# EAGLE board esp32_logging (EAGLE 9.6.2)
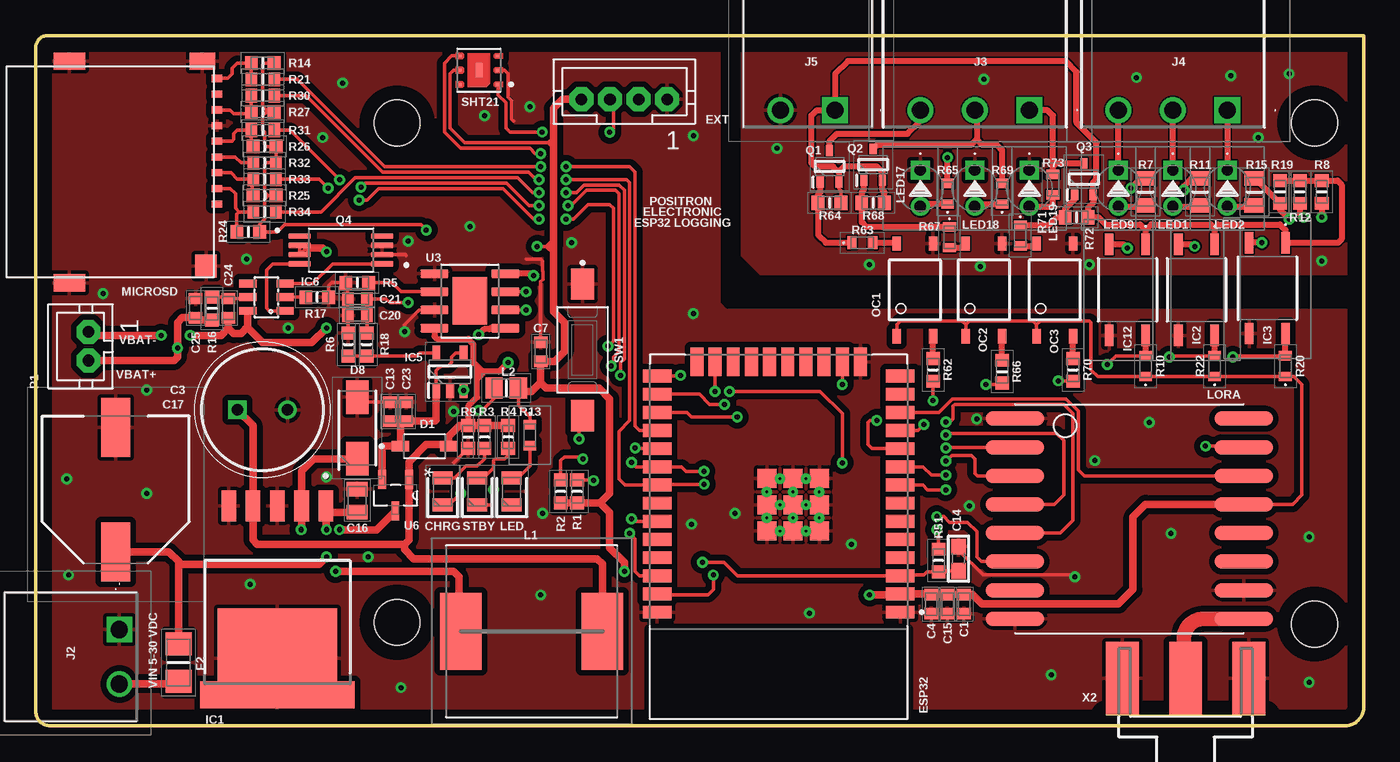
[diagram p2: board, top side]
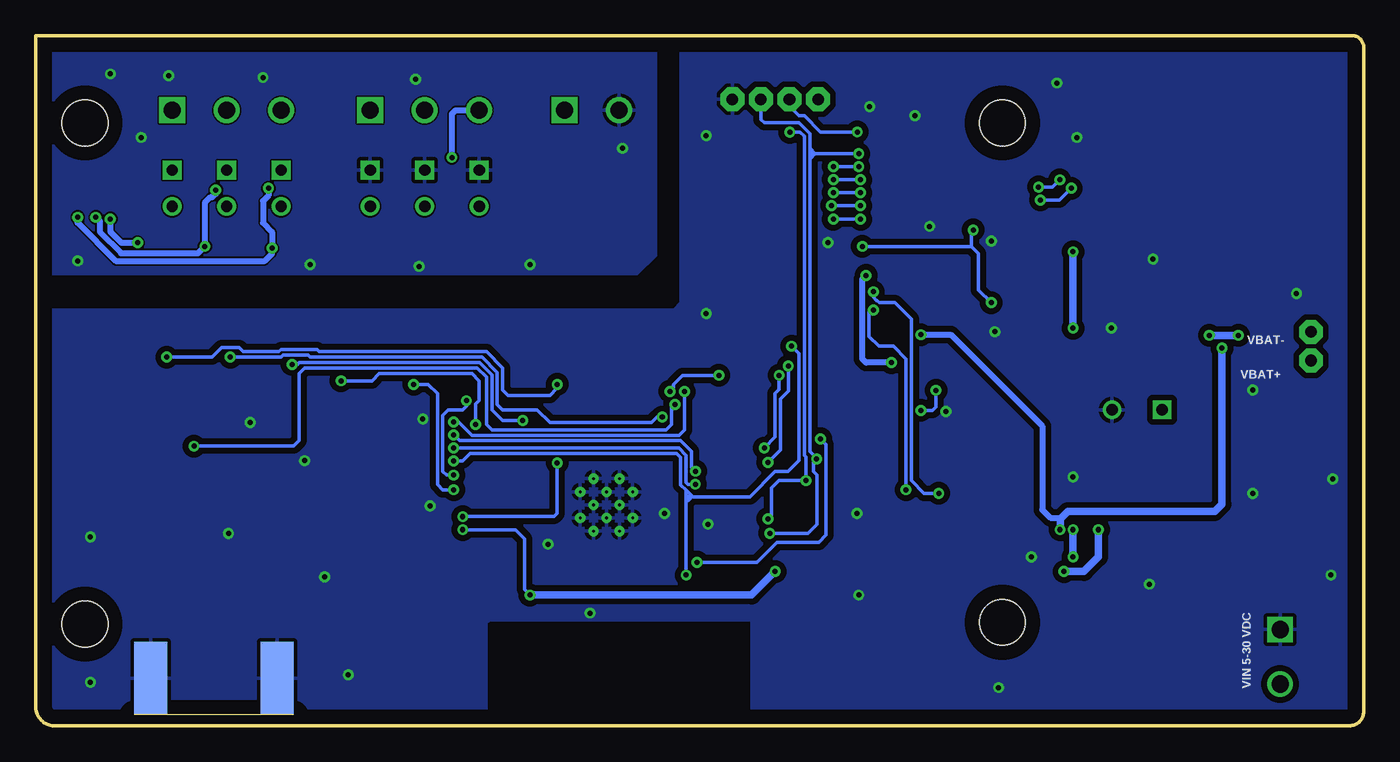
[diagram p3: board, bottom side, seen from below]

Size 92.85 x 48.26 mm. Coordinates in mm from the lower left corner, seen from the top.
Outline: 0.75,48.26 92.84,48.26 92.84,1.51 arc-90 91.71,0 1,0 arc-90 0,1 0,47.39 arc-90 0.75,48.26
Copper layers (1*16): Top 0.035mm / dielectric 1.5mm / Bottom 0.035mm
Design rules "default *": minimum track width 6mil, minimum drill 0.35mm, track to track 5mil, track to pad 5mil, pad to pad 5mil, via to via 6mil, smd to smd 5mil, copper to edge 40mil, drill to drill 6mil, minimum pad ring 10mil, minimum via ring 8mil, stop-mask expansion 4mil, vias tented up to drill 0.36mm, thermal gap 10mil
Holes 3.2 mm at 25.28,7.24 89.41,7.11 89.41,42.16 25.28,42.16

## Footprints (pad centres in the part's own frame; a part is rotated, then mirrored left to right if it is on the bottom)
CAPC1608X87N = smd 0.8 x 0.94: 1 -0.67,0; 2 0.67,0
CAPPRD350W60D850H1250 = drill 0.8 pad 1.2 square: 1 0,0 | drill 0.8 pad 1.2: 2 3.5,0
0603 = smd 1.1 x 1: 1 -0.85,0; 2 0.85,0
CAPC2012X140N = smd 1.02 x 1.47: 1 -0.81,0; 2 0.81,0
EEHZS1H221P = smd 4.1 x 2: 1 -4.35,0; 2 4.35,0
LEDC2012X80N = smd 0.9 x 1.4: 1 -0.95,0; 2 0.95,0
SOD3715X145N = smd 1.21 x 0.73: A 1.68,0; C -1.68,0
DIOM5226X240N = smd 2.35 x 1.55: 1 -2.15,0; 2 2.15,0
MODULE_ESP32-WROOM-32D = smd 2 x 0.9: 1 -8.5,5.26; 2 -8.5,3.99; 3 -8.5,2.72; 4 -8.5,1.45; 5 -8.5,0.18; 6 -8.5,-1.09; 7 -8.5,-2.36; 8 -8.5,-3.63; 9 -8.5,-4.9; 10 -8.5,-6.17; 11 -8.5,-7.44; 12 -8.5,-8.71; 13 -8.5,-9.98; 14 -8.5,-11.25; 25 8.5,-11.25; 26 8.5,-9.98; 27 8.5,-8.71; 28 8.5,-7.44; 29 8.5,-6.17; 30 8.5,-4.9; 31 8.5,-3.63; 32 8.5,-2.36; 33 8.5,-1.09; 34 8.5,0.18; 35 8.5,1.45; 36 8.5,2.72; 37 8.5,3.99; 38 8.5,5.26 | smd 0.9 x 2: 15 -5.715,-12.25; 16 -4.445,-12.25; 17 -3.175,-12.25; 18 -1.905,-12.25; 19 -0.635,-12.25; 20 0.635,-12.25; 21 1.905,-12.25; 22 3.175,-12.25; 23 4.445,-12.25; 24 5.715,-12.25 | smd 1.33 x 1.33: 39_1 -2.835,-0.405; 39_2 -1,-0.405; 39_3 0.835,-0.405; 39_4 -2.835,-2.24; 39_5 -1,-2.24; 39_6 0.835,-2.24; 39_7 -2.835,-4.075; 39_8 -1,-4.075; 39_9 0.835,-4.075 | drill 0.2 pad 0.3: 39_10 -1.917,-0.405; 39_11 -0.083,-0.405; 39_12 -2.835,-1.323; 39_13 -1,-1.323; 39_14 0.835,-1.323; 39_15 -1.917,-2.24; 39_16 -0.083,-2.24; 39_17 -2.835,-3.158; 39_18 -1,-3.158; 39_19 0.835,-3.158; 39_20 -1.917,-4.075; 39_21 -0.083,-4.075
JST-PH4 = drill 0.813 pad 1.676 octagon: 1 3,0; 2 1,0; 3 -1,0; 4 -3,0
FUSC3216X75N = smd 1.61 x 1.82: 1 -1.3,0; 2 1.3,0
KTT0005B = smd 2.16 x 1.02: 1 12.461,-3.4; 2 12.461,-1.7; 3 12.461,0; 4 12.461,1.7; 5 12.461,3.4 | smd 6.99 x 8.33: 6 1.786,0 | smd 1.91 x 1.235: 7 -0.754,4.782; 8 -0.754,-4.782
EL357 = smd 1.5 x 0.6: 1 -3.175,1.27; 2 -3.175,-1.27; 3 3.175,-1.27; 4 3.175,1.27
SOT95P280X100-5N = smd 1.05 x 0.55: 1 -1.3,0.95; 2 -1.3,0; 3 -1.3,-0.95; 4 1.3,-0.95; 5 1.3,0.95
SOT23-6 = smd 0.55 x 1.2: 1 -0.95,-1.3; 2 0,-1.3; 3 0.95,-1.3; 4 0.95,1.3; 5 0,1.3; 6 -0.95,1.3
1803277 = drill 1.2 pad 1.8 square: 1 0,0 | drill 1.2 pad 1.8: 2 3.81,0
1803280 = drill 1.2 pad 1.8 square: 1 0,0 | drill 1.2 pad 1.8: 2 3.81,0; 3 7.62,0
WE-PD_1260/1245/1280/121054 = smd 2.9 x 5.4: 1 -4.95,0; 2 4.95,0
INDC2012X105N = smd 1.2 x 1.45: 1 -0.85,0; 2 0.85,0
LTL4231N = drill 0.8 pad 1.3 square: 1 0,0 | drill 0.8 pad 1.3: 2 -2.54,0
MICROSD-PUSH-OUT = smd 0.5 x 0.75: 1 9.625,0.225; 2 8.525,0.225; 3 7.425,0.225; 4 6.325,0.225; 5 5.225,0.225; 6 4.125,0.225; 7 3.025,0.225; 8 1.925,0.225; CD 0.825,0.225 | smd 1.2 x 1.8: G1 -0.375,-0.8 | smd 1.2 x 2.2: G2 -0.375,-10.1; G4 15.125,-10.1 | smd 1.6 x 1.5: G3 13.95,-0.55
SO-4 = smd 1 x 0.6: 1 -3.24,0.635; 2 -3.24,-1.905; 3 3.24,-1.905; 4 3.24,0.635
JST-PH2 = drill 0.813 pad 1.676 octagon: 1 1,0; 2 -1,0
SOT65P210X100-3N = smd 0.75 x 0.5: 1 -1.1,0.65; 2 -1.1,-0.65; 3 1.1,0
SOP65P640X120-8N = smd 1.56 x 0.4: 1 -2.88,0.975; 2 -2.88,0.325; 3 -2.88,-0.325; 4 -2.88,-0.975; 5 2.88,-0.975; 6 2.88,-0.325; 7 2.88,0.325; 8 2.88,0.975
RESC1608X55N = smd 0.9 x 0.95: 1 -0.8,0; 2 0.8,0
RESC2012X60N = smd 1 x 1.45: 1 -0.95,0; 2 0.95,0
ERA3AEB101V = smd 0.65 x 0.9: 1 -0.725,0; 2 0.725,0
ERJH3 = smd 0.65 x 0.9: 1 -0.725,0; 2 0.725,0
RESC1608X55N' = smd 0.9 x 1: 1 -0.8,0; 2 0.8,0
RESC1608X55N'' = smd 0.8 x 0.95: 1 -0.8,0; 2 0.8,0
XDCR_SHT21 = smd 0.3 x 0.2: 1 -1.35,1; 2 -1.35,0; 3 -1.35,-1; 4 1.35,1; 5 1.35,0; 6 1.35,-1 | smd 0.5 x 1: 7 0,0
FSMSM = smd 2.18 x 1.6: 1 -4.6,0; 2 4.6,0
SOP127P600X175-9N = smd 1.97 x 0.6: 1 -2.475,1.905; 2 -2.475,0.635; 3 -2.475,-0.635; 4 -2.475,-1.905; 5 2.475,-1.905; 6 2.475,-0.635; 7 2.475,0.635; 8 2.475,1.905 | smd 2.413 x 3.302: 9 0,0
SOT95P237X112-3N = smd 1.321 x 0.559: 1 -1.092,0.94; 2 -1.092,-0.94 | smd 1.321 x 0.508: 3 1.092,0
HOPERF_RFM95W = smd 4.064 x 1.016: 1 -8.12,7.13; 2 -8.12,5.13; 3 -8.12,3.13; 4 -8.12,1.13; 5 -8.12,-0.87; 6 -8.12,-2.87; 7 -8.12,-4.87; 8 -8.12,-6.87; 9 7.88,-6.87; 10 7.88,-4.87; 11 7.88,-2.87; 12 7.88,-0.87; 13 7.88,1.13; 14 7.88,3.13; 15 7.88,5.13; 16 7.88,7.13
J502-ND-142-0701-801/806 = smd 5.08 x 2.286: 1 2.565,0; G@1 2.565,4.42; G@2 2.565,-4.42 | smd 5.08 x 2.286 bottom: G@3 2.565,4.42; G@4 2.565,-4.42

## Placement (x,y rotation side)
C1  100nf  [CAPC1608X87N]  64.9,8.51 90 top
C3  220uf 25V  [CAPPRD350W60D850H1250]  14.1,22.1 0 top
C4  10nf  [CAPC1608X87N]  62.61,8.51 90 top
C7  100nf  [CAPC1608X87N]  35.31,26.16 270 top
C13  100nf  [CAPC1608X87N]  24.77,21.97 270 top
C14  1uF  [0603]  64.52,11.68 90 top
C15  100nf  [CAPC1608X87N]  63.76,8.51 90 top
C16  2.2uf  [CAPC2012X140N]  22.48,15.75 90 top
C17  680uf  [EEHZS1H221P]  5.59,16.51 90 top
C20  1uf  [CAPC1608X87N]  22.48,28.7 0 top
C21  10nf  [CAPC1608X87N]  22.48,29.85 0 top
C23  100nf  [CAPC1608X87N]  25.91,21.97 270 top
C24  100nf  [CAPC1608X87N]  13.46,29.21 90 top
C25  100nf  [CAPC1608X87N]  11.18,29.21 270 top
CHRG  Green  [LEDC2012X80N]  28.45,16.38 90 top
D1  1N5819HW-7  [SOD3715X145N]  27.18,19.56 0 top
D8  B340A-13-F  [DIOM5226X240N]  22.48,20.83 90 top
ESP32  ESP32-WROOM-32D  [MODULE_ESP32-WROOM-32D]  51.95,13.21 180 top
EXT  [JST-PH4]  41.15,43.81 0 top
F2  0ZCJ0010FF2E  [FUSC3216X75N]  9.98,4.42 90 top
IC1  LM2596SX-5.0_NOPB  [KTT0005B]  16.89,2.92 90 top
IC2  EL357  [EL357]  81.16,30.48 270 top
IC3  EL357  [EL357]  86.11,30.61 270 top
IC5  M3406-ADJ  [SOT95P280X100-5N]  28.96,24.77 90 top
IC6  DW01A  [SOT23-6]  16.13,29.97 90 top
IC12  EL357  [EL357]  76.33,30.48 270 top
J2  1803277  [1803277]  5.84,6.73 270 top
J3  1803280  [1803280]  69.47,43.05 180 top
J4  1803280  [1803280]  83.31,43.05 180 top
J5  1803277  [1803277]  55.88,43.05 180 top
L1  33uh 12x12  [WE-PD_1260/1245/1280/121054]  34.67,6.6 0 top
L2  MLF2012A2R2KT000  [INDC2012X105N]  32.9,23.62 0 top
LED  Green  [LEDC2012X80N]  33.28,16.38 90 top
LED1  LTL-4231N  [LTL4231N]  79.5,38.86 90 top
LED2  LTL-4231N  [LTL4231N]  83.31,38.86 90 top
LED9  LTL-4231N  [LTL4231N]  75.69,38.86 90 top
LED17  LTL-4231N  [LTL4231N]  61.85,38.86 90 top
LED18  LTL-4231N  [LTL4231N]  65.66,38.86 90 top
LED19  LTL-4231N  [LTL4231N]  69.47,38.86 90 top
MICROSD  MICROSD-PUSH-OUT  [MICROSD-PUSH-OUT]  12.45,46.1 270 top
OC1  TLP181  [SO-4]  60.84,30.48 90 top
OC2  TLP181  [SO-4]  65.66,30.48 90 top
OC3  TLP181  [SO-4]  70.61,30.48 90 top
P1  [JST-PH2]  3.69,26.54 90 top
Q1  BSS84PW  [SOT65P210X100-3N]  55.5,39.12 90 top
Q2  BSS84PW  [SOT65P210X100-3N]  58.55,39.24 90 top
Q3  BSS84PW  [SOT65P210X100-3N]  73.28,38.23 90 top
Q4  FS8205A  [SOP65P640X120-8N]  21.34,33.27 0 top
R1  10k  [RESC1608X55N]  37.85,16.38 270 top
R2  10k  [RESC1608X55N]  36.71,16.38 270 top
R3  1k  [RESC1608X55N]  31.37,20.19 270 top
R4  1k  [RESC1608X55N]  33.02,20.19 270 top
R5  1.2k  [RESC1608X55N]  22.48,30.99 0 top
R6  10k  [RESC1608X55N]  21.85,26.67 90 top
R7  2.2k  [RESC2012X60N]  77.6,37.34 90 top
R8  10K  [RESC1608X55N]  89.92,37.34 270 top
R9  10k  [RESC1608X55N]  30.23,20.19 90 top
R10  4k7  [ERA3AEB101V]  77.6,25.15 90 top
R11  2.2k  [RESC2012X60N]  81.41,37.34 90 top
R12  10K  [RESC1608X55N]  88.39,37.34 270 top
R13  330  [ERJH3]  34.55,20.32 270 top
R14  10k  [RESC1608X55N]  15.88,46.35 0 top
R15  2.2k  [RESC2012X60N]  85.22,37.34 90 top
R16  100  [RESC1608X55N]  12.32,29.18 270 top
R17  1k  [RESC1608X55N]  19.69,29.97 180 top
R18  40k2  [RESC1608X55N']  23.12,26.67 90 top
R19  10K  [RESC1608X55N]  87,37.34 270 top
R20  4k7  [ERA3AEB101V]  87.38,25.15 90 top
R21  0  [RESC1608X55N'']  15.88,45.21 0 top
R22  4k7  [ERA3AEB101V]  82.43,25.15 90 top
R24  10k  [RESC1608X55N]  14.86,34.54 0 top
R25  10k  [RESC1608X55N]  16,37.08 0 top
R26  10k  [RESC1608X55N]  16,40.51 0 top
R27  10k  [RESC1608X55N]  15.88,42.93 0 top
R30  0  [RESC1608X55N'']  15.88,44.07 0 top
R31  0  [RESC1608X55N'']  15.88,41.66 0 top
R32  0  [RESC1608X55N'']  16,39.37 0 top
R33  0  [RESC1608X55N'']  16,38.23 0 top
R34  0  [RESC1608X55N'']  16,35.94 0 top
R51  10k  [RESC1608X55N]  63.12,11.56 270 top
R62  1k  [RESC1608X55N]  62.74,24.89 90 top
R63  4k7  [ERA3AEB101V]  57.79,33.78 0 top
R64  5.1k  [RESC1608X55N']  55.5,36.58 0 top
R65  4k7  [ERA3AEB101V]  63.76,37.21 90 top
R66  1k  [RESC1608X55N]  67.57,24.77 90 top
R67  4k7  [ERA3AEB101V]  63.88,34.16 270 top
R68  5.1k  [RESC1608X55N']  58.55,36.58 0 top
R69  4k7  [ERA3AEB101V]  67.57,37.21 90 top
R70  1k  [RESC1608X55N]  72.52,24.89 90 top
R71  4k7  [ERA3AEB101V]  68.84,34.29 270 top
R72  5.1k  [RESC1608X55N']  72.77,35.56 0 top
R73  4k7  [ERA3AEB101V]  71.12,37.85 90 top
SHT21  SHT21  [XDCR_SHT21]  30.99,45.85 180 top
STBY  Green  [LEDC2012X80N]  30.86,16.38 90 top
SW1  FSMSM  [FSMSM]  38.23,26.29 270 top
U3  TP4056  [SOP127P600X175-9N]  30.36,29.72 0 top
U6  SI2301BDS-T1-E3  [SOT95P237X112-3N]  25.15,16.13 270 top
U$1  HOPERF_RFM95W  [HOPERF_RFM95W]  76.58,14.35 0 top
X2  SMA-142-0701-801/806  [J502-ND-142-0701-801/806]  80.39,0.76 90 top

## Tracks (layer width: path | path; a pad name or v marks a point on that pad's centre or on a via)
0  (via drill 0.35)
  Top 0.254: U$1.6 66.12,11.48 65.79,11.81 65.79,13.59 65.15,14.22 63.88,14.22 63.48,14.62 v62.99,14.62 | v56.39,18.39 56.39,21.84 54.85,23.39 v48.52,23.39 | v45.09,24.51 45.03,24.46 ESP32.25
  Bottom 0.254: v62.99,14.62 56.62,14.62 56.39,14.86 v56.39,18.39 | v48.52,23.39 48.26,23.64 48.26,23.88 47.63,24.51 v45.09,24.51
3.3V  (via drill 0.35)
  Top 0.254: 16.26,37.08 16,36.83 16,35.43 15.66,35.09 R24.2 16.89,34.54 17.4,35.05 26.93,35.05 v27.31,34.67 | 16.26,37.08 R25.2 | 16.26,37.08 16,37.34 16,39.24 16.13,39.37 R32.2 R26.2 16.13,40.51 16,40.64 16,41.53 15.88,41.66 15.88,42.67 16.13,42.93 | 16.13,42.93 R27.2 | R18.2 23.15,27.51 C20.2 C21.2 24.51,29.85 24.77,29.59 v26.04,29.59 | L2.2 33.75,22.39 34.55,21.59 R13.1 | 65.03,28.07 64.77,28.32 60.45,28.32 60.2,28.07 OC1.1 | OC3.1 69.98,28.07 | 69.98,28.07 69.73,28.32 65.28,28.32 65.03,28.07 | 16.13,42.93 16.13,43.05 15.88,43.31 15.88,46.23 16,46.35 R14.2 | 65.03,28.07 OC2.1 | 69.98,28.07 70.23,28.32 73.66,28.32 73.79,28.19 73.79,24.89 74.26,24.42 R10.1 R22.1 R20.1 87.98,24.42 88.52,23.88 88.52,16.13 87.87,15.48 U$1.13 | R51.1 63.12,13.59 v62.99,13.72 | SHT21.5 29.21,45.85 28.96,45.59 28.96,41.78 29.97,40.77 35.82,40.77 | 35.82,40.77 36.2,41.15 | 35.82,40.77 36.2,40.39 36.2,40.26 | v35.05,33.53 35.69,33.53 | 36.2,33.53 35.69,33.53 | 35.69,33.53 36.2,34.04 | 35.69,33.53 36.2,33.02
  Top 0.508: L2.2 34,23.37 34.67,23.37 35.31,24 | 35.31,24 C7.2 36.29,25.49 36.96,26.16 36.96,28.19 36.2,28.96 36.2,33.02 36.2,33.53 36.2,34.04 36.2,40.26 36.2,41.15 36.2,43.18 36.83,43.81 EXT.4 | 35.31,24 35.69,23.62 39.37,23.62 40.13,22.86 40.13,16.26 39.46,15.58 | 39.46,15.58 R1.2 R2.2 | 39.46,15.58 40.13,14.91 40.13,12.45 41.15,11.43 v41.15,10.79 | v58.3,9.14 60.37,9.14 ESP32.2 62.57,9.22 C4.2 C15.2 C1.2 65.5,9.18 66.17,8.51 75.69,8.51 76.71,9.53 76.71,14.6 77.59,15.48 U$1.13
  Bottom 0.254: v62.99,13.72 59.31,13.72 58.68,13.08 58.68,9.53 v58.3,9.14 | 27.43,33.53 26.93,33.02 26.93,30.48 v26.04,29.59 | 27.43,33.53 v35.05,33.53 | v27.31,34.67 27.43,34.54 27.43,33.53
  Bottom 0.508: v41.15,10.79 42.8,9.14 v58.3,9.14
30  (via drill 0.35)
  Top 0.254: C14.1 63.67,10.83 63.59,10.76 R51.2 62.32,10.76 62.11,10.54 60.5,10.54 ESP32.3 49.08,10.49 48.14,11.43 v46.61,11.43 | v37.98,20.07 37.98,21.44 SW1.2
  Bottom 0.254: v46.61,11.43 42.42,11.43 41.02,12.83 38.1,12.83 37.59,13.33 37.59,19.69 v37.98,20.07
+5V  (via drill 0.35)
  Top 0.254: 30.61,20.99 R9.2
  Top 0.406: U3.4 27.88,27.24 28.07,27.05 30.23,27.05 30.61,26.67 30.61,25.4 30.86,25.15 | v34.8,31.5 34.67,31.62 U3.8 | R9.2 30.23,22.35 30.86,22.99 30.86,24.26 | 30.86,24.26 30.86,24.64 | 30.86,24.64 30.86,25.15 | v33.02,25.4 32.39,24.77 31.24,24.77 | 31.24,24.77 30.99,24.77 30.86,24.64 | 31.24,24.77 30.86,25.15 | 31.24,24.77 31.24,24.64 30.86,24.26
  Top 0.508: 30.61,20.99 29.63,20.99 28.86,20.22 D1.A 28.73,19.69 27.31,19.69 26.09,18.47 U6.1 26.09,13.01 25.78,12.7 | R9.2 R3.1 R4.1 | 25.78,12.7 15.5,12.7 15.19,13 IC1.4 15.19,21 C3.1 | L1.2 39.62,11.31 39.25,11.68 26.42,11.68 25.78,12.32 25.78,12.7
  Bottom 0.406: v33.02,25.4 34.8,25.4 35.05,25.65 35.05,31.24 v34.8,31.5
CHRG  (via drill 0.35)
  Top 0.254: U3.7 v34.29,30.35 | v29.72,16.26 28.9,15.43 CHRG.1
  Bottom 0.254: v34.29,30.35 34.29,29.97 34.06,29.74 34.02,29.74 33.87,29.59 32.77,29.59 31.63,28.45 31.63,17.14 30.74,16.26 v29.72,16.26
CLK  (via drill 0.35)
  Top 0.254: U$1.4 71.24,15.48 71.88,16.13 71.88,19.94 71.38,20.45 63.74,20.45 v63.63,20.34 | v46.72,17.8 45.45,17.8 45.14,18.11 ESP32.30 41.97,18.11 v41.66,18.42 | v40.24,25.16 40.39,25.31 40.39,25.78 40.77,26.16 40.77,37.21 40.54,37.45 38.49,37.45 37.44,36.39 v37.21,36.39 | v35.18,36.37 34.5,36.37 32.92,37.95 23.01,37.95 v22.74,37.68 | v21.25,38.18 17.78,41.66 R31.2
  Bottom 0.254: v63.63,20.34 63.38,20.09 63.36,20.09 63.21,19.94 47.75,19.94 46.99,19.18 46.99,18.08 v46.72,17.8 | v41.66,18.42 40.77,19.3 40.77,22.86 40.22,23.41 40.22,24.78 40.24,24.81 v40.24,25.16 | v37.21,36.39 35.2,36.39 v35.18,36.37 | v22.74,37.68 21.76,37.68 v21.25,38.18
CS_LORA  (via drill 0.35)
  Top 0.254: U$1.5 71.65,13.48 72.52,14.35 72.52,21.84 71.88,22.48 65.79,22.48 64.26,22.48 64.14,22.35 64.14,21.46 63.92,21.25 v63.63,21.25 | v47.5,23.37 ESP32.23
  Bottom 0.254: v63.63,21.25 63.29,21.25 62.36,20.32 47.88,20.32 47.5,20.7 v47.5,23.37
CS_SDCARD  (via drill 0.35)
  Top 0.254: ESP32.29 41.97,19.38 v41.91,19.43 | v40.87,24.51 40.9,24.53 40.9,25.4 41.15,25.65 41.15,37.45 40.77,37.83 38.34,37.83 37.81,37.3 v37.09,37.3 | v35.18,37.28 34.73,37.28 33.68,38.33 22.33,38.33 19.94,35.94 R34.2
  Bottom 0.254: v41.91,19.43 41.15,20.19 41.15,23.24 40.87,23.52 v40.87,24.51 | v37.09,37.3 35.2,37.3 v35.18,37.28
CUT
  cutout Bottom: 42.93,-0.13 42.93,7.24 61.09,7.24 61.22,7.11 61.22,-0.13
GND  (via drill 0.35)
  Top 0.254: R17.1 20.49,30.77 20.7,30.99 R5.1 21.81,30.86 C21.1 21.81,28.83 | C20.1 21.81,28.83 | R6.2 21.85,28.79 21.81,28.83 | C23.1 C13.1 22.82,22.64 D8.2 | SHT21.2 32.77,45.85 33.02,45.59 33.02,43.97 33.28,43.72 33.28,42.42 33.4,42.29 | Q4.6 25.85,32.95 25.91,32.89 | R9.1 29.25,18.42 29.21,18.42 | U3.3 26.8,29.08 25.78,28.07 v25.78,27.56 | C7.1 35.31,31.07 35.46,31.22 35.46,31.77 35.44,31.79 35.44,32.51 35.31,32.64 34.29,32.64 | C14.2 64.52,12.28 66.26,10.54 72.52,10.54 v72.65,10.41
  other vias: 45.98,28.83 65.79,21.46 65.28,15.37 74.04,18.54 77.85,21.21 79.38,13.46 89.03,13.21 89.03,3.05 71,3.56 54.1,7.87 57.03,12.7 48.9,14.86 45.85,14.1 35.44,14.86 35.31,9.14 23.24,11.81 14.99,9.91 7.75,16.26 2.29,10.54 2.16,17.27 7.75,23.5 4.7,30.23 14.73,32.64 30.36,34.92 21.47,44.96 20.07,41.15 31.37,42.67 34.55,43.31 45.98,41.27 20.32,17.4 29.21,21.97 17.66,27.81 26.04,33.91 37.47,33.78 25.53,2.67
  pour Bottom (isolate 0.406, rank 2): 0.64,48.89 47.12,48.89 47.75,48.26 47.75,29.59 48.26,29.08 92.59,29.08 92.84,28.83 92.84,-0.38 0.64,-0.38
  pour Top (isolate 0.406, rank 2): 0.64,48.89 46.99,48.89 47.75,48.13 47.75,29.59 48.26,29.08 92.67,29.08 93.22,29.08 93.22,28.96 93.22,-0.25 0.62,-0.25 0.5,29.97 0.64,29.97
GNDI  (via drill 0.35)
  other vias: 51.82,40.39 66.3,45.21 76.96,45.34 83.57,45.47 87.63,45.59 85.47,41.15 89.92,32.51 73.66,32.26 66.04,32.13 58.3,32.26
  pour Top: 49.41,48.26 92.84,48.26 92.84,31.62 50.68,31.62 49.41,32.89
  pour Bottom: 92.84,48.26 92.84,31.62 50.8,31.62 49.53,32.89 49.53,47.75 49.41,47.88 49.41,48.26 49.66,48.26
IN_D1  (via drill 0.35)
  Top 0.254: R10.2 75.53,25.87 v74.93,25.27 | v58.8,21.36 58.32,21.36 58.17,21.21 58.17,19.69 58.48,19.38 ESP32.10
  Top 0.406: R10.2 IC12.4
  Bottom 0.254: v74.93,25.27 74.55,25.27 74.42,25.4 61.82,25.4 60.96,24.54 60.96,22.1 60.22,21.36 v58.8,21.36
IN_D2  (via drill 0.35)
  Top 0.254: R22.2 79.34,25.87 v79.25,25.78 | v49.05,21.59 45.85,21.59 45.52,21.92 ESP32.27
  Top 0.406: R22.2 IC2.4
  Bottom 0.254: v79.25,25.78 75.69,25.78 75.54,25.93 73.81,25.93 73.66,25.78 61.66,25.78 60.58,24.7 60.58,22.48 60.2,22.1 57.79,22.1 56.9,21.21 49.79,21.21 49.41,21.59 v49.05,21.59
IN_D3  (via drill 0.35)
  Top 0.254: R20.2 83.79,25.87 v83.7,25.78 | v56.39,23.88 ESP32.16
  Top 0.406: R20.2 IC3.4
  Bottom 0.254: v83.7,25.78 80.52,25.78 79.86,26.44 78.64,26.44 78.36,26.16 75.85,26.16 75.7,26.31 73.18,26.31 73.03,26.16 61.34,26.16 60.2,25.02 60.2,23.5 59.82,23.11 56.9,23.11 56.39,23.62 v56.39,23.88
INPUT_D1
  Top 0.406: LED9.1 J4.3
INPUT_D2
  Top 0.406: LED1.1 J4.2
INPUT_D3
  Top 0.406: J4.1 LED2.1
IO0_LORA
  Top 0.254: U$1.14 73.33,17.48 72.9,17.91 72.9,22 72.04,22.86 64.11,22.86 63.16,21.92 ESP32.12
IO1_LORA  (via drill 0.35)
  Top 0.254: ESP32.26 46.41,23.19 47.12,22.48 v48.16,22.48 | v81.79,19.56 83.06,19.56 83.31,19.3 83.44,19.3 83.7,19.56 84.39,19.56 U$1.15
  Bottom 0.254: v48.16,22.48 48.39,22.25 48.39,21.08 48.77,20.7 60.96,20.7 61.34,21.08 61.34,24.38 61.98,25.02 74.04,25.02 74.42,24.64 74.42,19.94 74.81,19.56 v81.79,19.56
MISO  (via drill 0.35)
  Top 0.254: U$1.2 63.68,19.48 v63.63,19.43 | v46.74,16.89 43.5,16.89 ESP32.31 41.2,16.84 40.77,17.27 40.77,20.57 41.53,21.34 41.53,37.97 41.3,38.21 v37.09,38.21 | R30.2 18.89,44.07 24.25,38.71 34.44,38.71 34.97,38.19 v35.18,38.19
  Bottom 0.254: v63.63,19.43 47.88,19.43 47.37,18.92 47.37,17.02 47.25,16.89 v46.74,16.89 | v35.18,38.19 35.2,38.21 v37.09,38.21
MOSI  (via drill 0.35)
  Top 0.254: U$1.3 65.83,17.48 65.66,17.65 65.66,18.67 65.41,18.92 64.05,18.92 63.9,18.77 63.88,18.77 v63.63,18.52 | v47.37,10.54 47.37,9.53 46.99,9.14 43.52,9.14 ESP32.37 | R33.2 19.81,38.23 v20.45,37.59 | v22.61,36.77 23.18,36.77 23.99,37.57 32.66,37.57 34.8,35.43 v35.18,35.43 | v37.09,35.43 37.59,35.43 38.61,36.45 40.13,36.45 40.39,36.2 40.39,26.92 v40.01,26.54
  Bottom 0.254: v63.63,18.52 63.01,18.52 62.49,19.05 48.04,19.05 47.75,18.77 47.75,16.86 47.37,16.48 | 47.37,16.48 47.37,16.13 | 47.37,16.13 47.37,15.62 | 47.37,15.62 v47.37,10.54 | v20.45,37.59 21.27,36.77 v22.61,36.77 | v35.18,35.43 v37.09,35.43 | v40.01,26.54 39.5,26.04 39.5,18.54 40.26,17.78 41.15,17.78 42.93,16 46.9,16 | 47.37,16.13 47.25,16 46.99,16 | 46.9,16 46.99,16 | 47.12,15.87 47.37,15.62 | 47.12,15.87 47.12,16.23 | 47.37,16.48 47.12,16.23 | 47.12,16.23 46.9,16 | 46.99,16 47.12,15.87
N$1
  Top 0.254: IC5.1 28.01,24.83 28.32,25.15 28.83,25.15 29.09,25.4 29.09,25.78 29.37,26.07 IC5.4 | 25.5,20.89 C23.2 C13.2 25.09,21.3 25.5,20.89
  Top 0.508: 25.5,20.89 D1.C 24.39,19.56 24.21,19.38 U6.2 | C23.2 27.91,21.3 28.01,21.4 IC5.1
N$2
  Top 0.254: MICROSD.CD 13.4,45.28 13.72,45.59 13.72,45.97 14.1,46.35 R14.1 R21.1
N$3
  Top 0.254: R16.1 13.36,29.99 C24.2 14.74,29.88 IC6.5
N$4
  Top 0.254: R4.2 33.02,18.92 32.77,18.67 32.47,18.67 32.13,18.67 32.01,18.54 32.01,18.03 31.31,17.33 STBY.2
N$5
  Top 0.254: R30.1 R27.1 14.95,42.8 13.85,42.8 13.59,43.05 12.7,43.05 MICROSD.7
N$6
  Top 0.254: R5.2 24.89,30.99 25.53,30.35 U3.2
N$7
  Top 1.016: U$1.9 81.65,7.48 arc90 80.27,6.1 80.27,3.45 arc90 X2.1
N$8
  Top 0.254: IC6.1 16.32,29.02 16.13,29.21 16.13,31.88 16.55,32.3 Q4.4
N$9
  Top 0.254: R26.1 15.08,40.64 R31.1 14.1,41.66 13.85,41.4 13.85,41.02 13.72,40.89 12.69,40.89 MICROSD.5
N$10  (via drill 0.35)
  Top 0.254: IC5.3 30.07,23.62 | L2.1 32.05,22.9 31.2,22.05 v30.97,22.05
  Bottom 0.254: v30.97,22.05 30.15,22.05 29.91,22.29 IC5.3
  other vias: 29.91,23.46
N$11
  Top 0.254: R33.1 15.12,38.23 | 15.12,38.23 14.1,38.23 13.65,38.68 MICROSD.3 | R25.1 15.12,37.17 15.12,38.23
N$12
  Top 0.254: R34.1 14.23,35.94 | 14.23,35.94 13.97,36.2 13.97,37.21 13.61,37.58 MICROSD.2 | R24.1 14.06,35.78 14.23,35.94
N$13  (via drill 0.35)
  Top 0.406: R12.2 88.39,35.81 v88.65,35.56 | v81.03,33.53 80.9,33.66 IC2.2 | R11.2 80.84,38.29 80.27,37.72 v80.27,37.46
  Bottom 0.406: v88.65,35.56 88.38,35.29 88.38,34.53 86.89,33.05 81.51,33.05 v81.03,33.53 81.03,36.58 80.65,36.96 80.52,36.96 80.27,37.21 v80.27,37.46
N$14  (via drill 0.35)
  Top 0.406: R8.2 v89.92,35.56 | v76.33,33.4 76.08,33.66 IC12.2 | R7.2 77.28,38.29 v76.58,37.59
  Bottom 0.406: v89.92,35.56 89.92,35.18 87.25,32.52 76.83,32.52 76.33,33.02 v76.33,33.4 76.33,34.54 76.96,35.18 76.96,36.7 76.58,37.08 v76.58,37.59
N$15
  Top 0.254: R3.2 31.37,18.67 30.86,18.16 30.1,18.16 29.27,17.33 CHRG.2
N$16
  Top 0.406: LED1.2 81.34,36.32 R11.1
N$17  (via drill 0.35)
  Top 0.406: R15.2 85.25,38.29 R19.2 87,36.09 v87.64,35.44 | v85.73,33.78 IC3.2
  Bottom 0.406: v87.64,35.44 87.64,34.55 86.87,33.78 v85.73,33.78
N$18
  Top 0.406: LED2.2 85.15,36.32 R15.1
N$20
  Top 0.254: 60.14,33.78 OC1.4
  Top 0.406: R63.2 60.14,33.78
N$21
  Top 0.254: R17.2 IC6.2
N$22
  Top 0.254: R6.1 R18.1 26.63,25.87 26.83,26.07 IC5.5
N$24  (via drill 0.35)
  Top 0.508: D8.1 19.44,18.68 18.59,17.83 IC1.2 18.59,13.76 v18.54,13.72 | v20.96,10.79 29.21,10.79 29.59,10.41 29.59,6.73 L1.1
  Bottom 0.508: v18.54,13.72 18.54,11.81 19.56,10.79 v20.96,10.79
N$26
  Top 0.254: Q4.5 20.74,32.3 19.37,30.92 IC6.3
N$29
  Top 0.254: R32.1 14.35,39.37 13.95,39.78 MICROSD.4
N$30
  Top 0.406: R62.2 OC1.2
N$31
  Top 0.406: R63.1 55.25,33.78 54.7,34.33 R64.1 54.7,37.17 54.87,37.34 54.87,38 Q1.1
N$32
  Top 0.406: R67.2 64.74,33.44 OC2.4
N$33
  Top 0.406: R65.1 62.02,36.49 LED17.2
N$34
  Top 0.254: LED.2 33.72,17.33 34.55,18.16 R13.2
N$35
  Top 0.406: R66.2 OC2.2
N$36
  Top 0.406: Q2.1 57.9,37.45 57.75,37.3 R68.1 57.75,35.22 58.08,34.89 R67.1
N$37
  Top 0.406: LED18.2 65.83,36.49 R69.1
N$38
  Top 0.406: R71.2 69.82,33.56 OC3.4
N$39
  Top 0.406: R70.2 OC3.2
N$40
  Top 0.406: Q3.1 72.63,36.81 71.97,36.16 R72.1 71.38,35.56 70.83,35.02 R71.1
N$41
  Top 0.406: LED19.2 71,36.32 71.12,36.45 R73.1
N$121
  Top 0.406: LED9.2 77.53,36.32 R7.1
OUT1  (via drill 0.35)
  Top 0.406: Q1.3 55.5,40.89 56.01,41.4 60.96,41.4 61.85,42.29 J3.3 | R65.2 v63.76,39.75
  Bottom 0.406: v63.76,39.75 63.76,42.8 63.5,43.05 J3.3
OUT2
  Top 0.406: Q2.3 58.85,40.64 65.41,40.64 65.79,41.02 | 65.79,41.02 65.79,42.93 J3.2 | 65.79,41.02 66.17,40.64 67.19,40.64 67.57,40.26 R69.2
OUT3
  Top 0.406: R73.2 71.12,39.12 | 71.12,39.12 71.12,39.54 | J3.1 70.74,43.05 71.12,42.67 71.12,39.62 71.12,39.54 | Q3.3 71.33,39.33 | 71.33,39.33 71.12,39.12 | 71.33,39.33 71.12,39.54
OUT_1  (via drill 0.35)
  Top 0.254: ESP32.9 62.03,18.11 62.61,17.53 v63.63,17.53 | v62.74,22.73 R62.1
  Bottom 0.254: v63.63,17.53 64.14,17.53 64.39,17.78 64.39,21.72 64.01,22.1 62.99,22.1 62.74,22.35 v62.74,22.73
OUT_2  (via drill 0.35)
  Top 0.254: ESP32.8 62.03,16.84 62.36,16.51 v63.63,16.51 | v66.42,23.88 67.48,23.88 R66.1
  Bottom 0.254: v63.63,16.51 64.39,16.51 64.77,16.89 64.77,23.24 65.41,23.88 v66.42,23.88
OUT_3  (via drill 0.35)
  Top 0.254: ESP32.11 61.67,20.65 v62.11,21.08 | v71.5,24.13 72.48,24.13 R70.1
  Bottom 0.254: v71.5,24.13 69.34,24.13 68.84,24.64 62.36,24.64 61.85,24.13 61.85,22.73 62.08,22.5 62.08,22.46 62.11,22.44 v62.11,21.08
PWRIN
  Top 0.508: F2.1 9.78,2.92 J2.2
SCL  (via drill 0.35)
  Top 0.254: ESP32.36 42.22,10.49 41.91,10.79 41.91,13.08 v41.53,13.46 | v38.25,18.67 38.13,18.8 36.96,18.8 36.71,18.54 R2.1 | SHT21.6 29.07,46.85 28.58,46.35 28.58,41.53 29.72,40.39 34.55,40.39 34.93,40 v35.31,40
  Bottom 0.254: v41.53,13.46 38.86,13.46 38.23,14.1 38.23,17.53 38.48,17.78 38.48,18.44 v38.25,18.67 38.25,18.69 38.74,19.18 38.74,39.37 38.74,39.62 | EXT.2 42.15,42.4 41.91,42.16 39.5,42.16 38.74,41.4 38.74,40.39 | 38.74,39.62 38.74,40 | 38.74,40 38.74,40.39 | v35.31,40 38.36,40 | 38.36,40 38.74,40 | 38.36,40 38.74,40.39 | 38.36,40 38.74,39.62
SD_DETECT  (via drill 0.35)
  Top 0.254: ESP32.28 42.22,20.65 41.91,20.96 41.91,38.73 41.53,39.12 v37.09,39.12 | v35.31,39.1 24.41,39.1 18.29,45.21 R21.2
  Bottom 0.254: v37.09,39.12 35.33,39.12 v35.31,39.1
SDA  (via drill 0.35)
  Top 0.254: R1.1 38.95,17.18 v38.99,17.14 | ESP32.33 41.84,14.3 v41.66,14.48 | v40.13,41.51 40.39,41.76 40.39,43.58 EXT.3 | SHT21.1 32.34,44.12 32.9,43.56 32.9,41.78 33.15,41.53 v35.41,41.53
  Bottom 0.254: v41.66,14.48 41.4,14.73 41.4,16.64 40.9,17.14 v38.99,17.14 38.99,18.8 39.12,18.92 39.12,41.24 39.4,41.53 40.11,41.53 v40.13,41.51 | v35.41,41.53 37.98,41.53 39.12,42.67 39.5,42.67 40.15,43.32 EXT.3
STBY  (via drill 0.35)
  Top 0.254: STBY.1 31.95,15.43 32.01,15.49 v32.01,16.51 | v34.29,29.08 U3.6
  Bottom 0.254: v32.01,16.51 32.01,25.65 32.9,26.54 33.91,26.54 34.6,27.23 34.6,28.96 34.47,29.08 v34.29,29.08
VBAT+  (via drill 0.35)
  Top 0.406: U3.5 31.77,27.81 31.7,27.74 31.36,27.74 v30.97,27.35
  Top 0.508: U6.3 23.83,13.72 v21.23,13.72 | R16.2 11.33,28.39 C25.2 10.25,28.54 9.91,28.19 v9.91,26.42 9.91,25.78 9.67,25.54 P1.2
  Bottom 0.406: v30.97,27.35 28.88,27.35 22.48,20.96 22.48,15.11 21.91,14.54 21.15,14.54
  Bottom 0.508: v21.23,13.72 21.21,13.74 21.21,14.48 21.15,14.54 20.7,14.99 10.42,14.99 9.91,15.49 v9.91,26.42
VBAT-  (via drill 0.35)
  Top 0.254: Q4.2 Q4.3 18.91,33.4 18.93,33.4
  Top 0.508: IC6.6 14.83,27.91 | 13.46,27.81 13.85,27.43 14.35,27.43 14.83,27.91 | C24.1 13.46,27.81 | 13.46,27.81 12.96,27.3 v10.8,27.3 | v8.77,27.3 3.92,27.3 P1.1 | 14.83,27.91 14.83,27.84 15.88,26.8 19.31,26.8 v20.32,27.81 | v20.32,33.15 20.07,33.4 18.93,33.4
  Bottom 0.508: v10.8,27.3 v8.77,27.3 | v20.32,27.81 v20.32,33.15
VCC  (via drill 0.35)
  Top 0.508: C16.1 20.74,14.94 IC1.1 20.29,13.74 v20.32,13.72 | C17.1 9.31,12.16 9.98,11.48 9.98,11.3 | 9.98,11.3 F2.2 | v20.32,11.81 19.81,11.3 9.98,11.3
  Bottom 0.508: v20.32,13.72 v20.32,11.81
VCCIO
  Top 0.254: R64.2 56.3,37.43 56.15,37.58 Q1.2
  Top 0.406: R68.2 59.35,37.3 59.2,37.45 Q2.2 59.2,38.72 58.8,39.12 56.52,39.12 56.15,38.75 | 56.15,38.75 Q1.2 | 56.15,38.75 56.12,38.75 55.76,39.12 54.49,39.12 54.23,39.37 54.23,42.67 54.61,43.05 J5.1 55.88,45.59 56.77,46.48 72.01,46.48 72.77,45.72 72.77,42.16 74.17,40.77 74.17,38.23 73.93,37.99 Q3.2 73.93,36.59 73.57,36.23 R72.2 74.3,35.56 74.81,35.05 77.22,35.05 77.6,34.67 | IC12.1 77.6,34.67 | 77.6,34.67 77.98,35.05 82.17,35.05 82.43,34.8 | IC2.1 82.43,34.8 | 82.43,34.8 82.68,35.05 87,35.05 87.38,34.67 IC3.1 91.06,33.78 91.32,34.04 91.32,37.85 91.02,38.14 R8.1 R12.1 R19.1

## Text on the board
tNames: POSITRON / ELECTRONIC / ESP32 LOGGING | VBAT- | VBAT+ | LORA | VIN 5-30 VDC
bNames: VBAT- | VBAT+ | VIN 5-30 VDC
214bmp: D:/SmartProjects/Snc/a4_bn_logo2.bmp